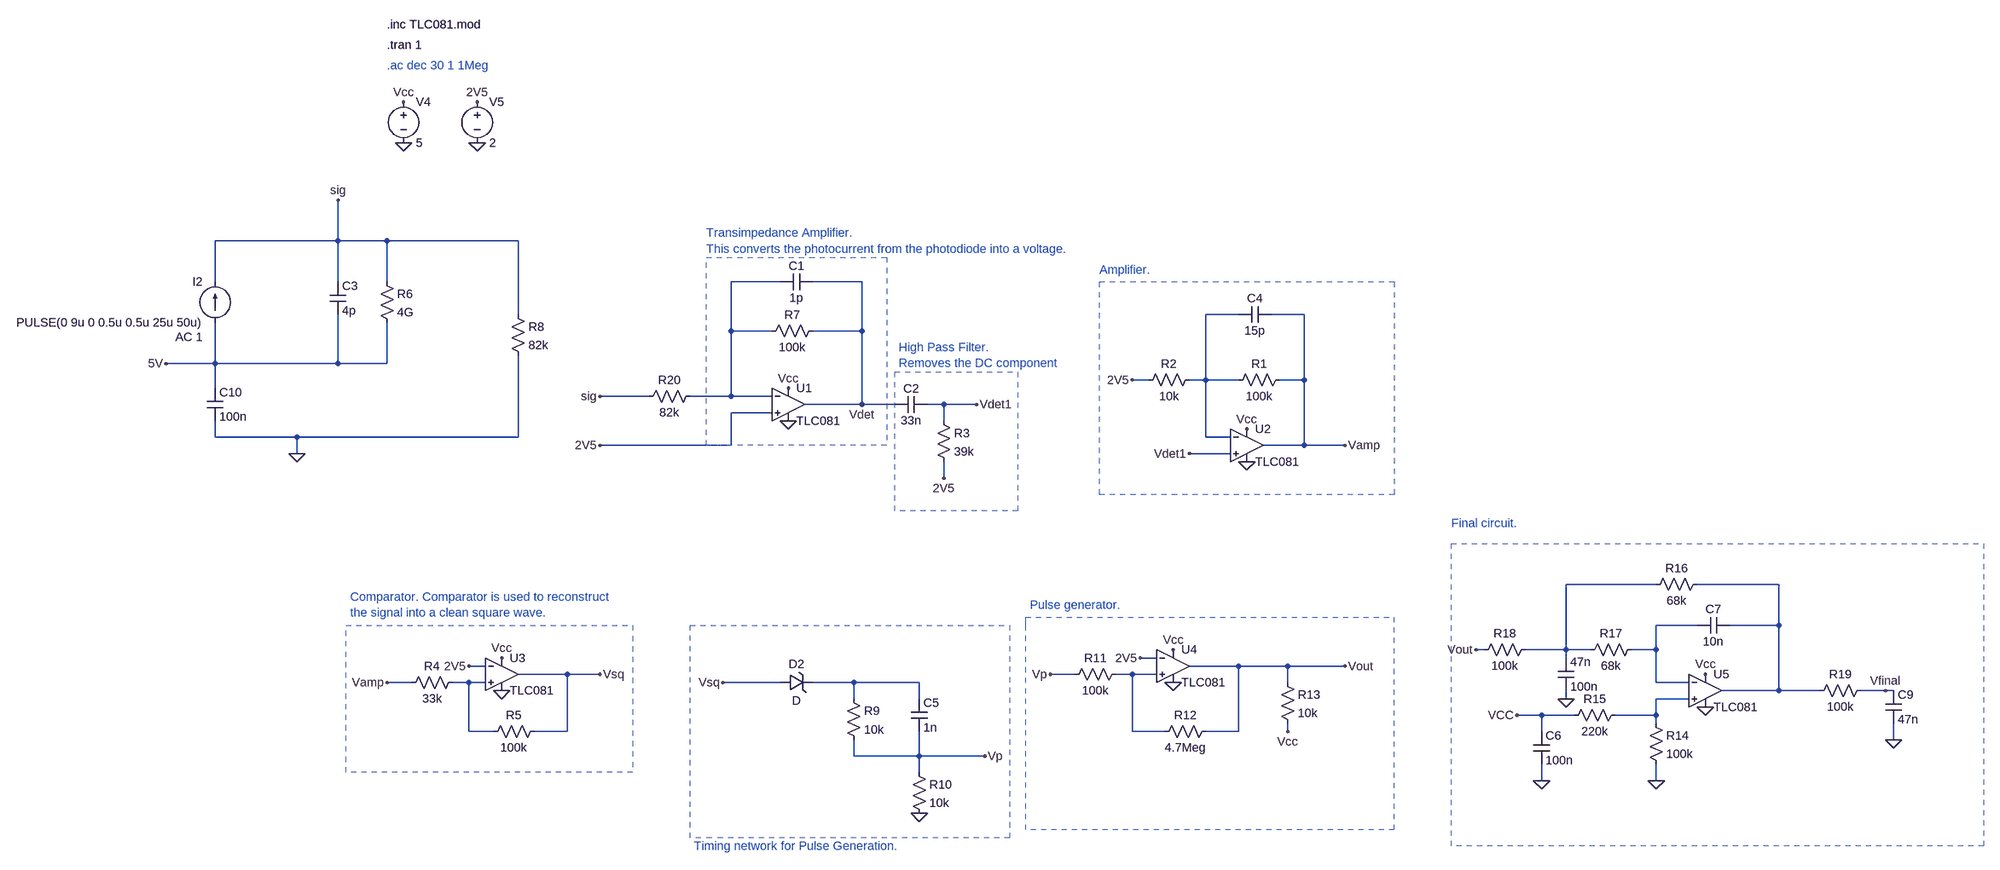
[diagram p0: schematic Receiver_finished.asc]
Receiver_finished.asc, the LTspice schematic file:
Version 4.1
SHEET 1 5412 1876
WIRE -1088 656 -1088 576
WIRE -1088 656 -1328 656
WIRE -992 656 -1088 656
WIRE -736 656 -992 656
WIRE -1328 736 -1328 656
WIRE -1088 736 -1088 656
WIRE -992 736 -992 656
WIRE -224 736 -320 736
WIRE -64 736 -160 736
WIRE -736 800 -736 656
WIRE 672 800 608 800
WIRE 800 800 736 800
WIRE -320 832 -320 736
WIRE -240 832 -320 832
WIRE -64 832 -64 736
WIRE -64 832 -160 832
WIRE -1328 896 -1328 816
WIRE -1328 896 -1424 896
WIRE -1088 896 -1088 800
WIRE -1088 896 -1328 896
WIRE -992 896 -992 816
WIRE -992 896 -1088 896
WIRE 496 928 464 928
WIRE 608 928 608 800
WIRE 608 928 576 928
WIRE 672 928 608 928
WIRE 800 928 800 800
WIRE 800 928 752 928
WIRE -1328 944 -1328 896
WIRE -480 960 -576 960
WIRE -320 960 -320 832
WIRE -320 960 -400 960
WIRE -240 960 -320 960
WIRE -64 976 -64 832
WIRE -64 976 -176 976
WIRE 0 976 -64 976
WIRE 96 976 64 976
WIRE 160 976 96 976
WIRE -240 992 -320 992
WIRE 96 1008 96 976
WIRE -1328 1040 -1328 1008
WIRE -1168 1040 -1328 1040
WIRE -736 1040 -736 880
WIRE -736 1040 -1168 1040
WIRE 608 1040 608 928
WIRE 656 1040 608 1040
WIRE -320 1056 -320 992
WIRE -320 1056 -576 1056
WIRE 800 1056 800 928
WIRE 800 1056 720 1056
WIRE 880 1056 800 1056
WIRE -1168 1072 -1168 1040
WIRE 656 1072 576 1072
WIRE 96 1120 96 1088
WIRE 1488 1328 1312 1328
WIRE 1728 1328 1568 1328
WIRE 1568 1408 1488 1408
WIRE 1728 1408 1728 1328
WIRE 1728 1408 1632 1408
WIRE 1152 1456 1136 1456
WIRE 1312 1456 1312 1328
WIRE 1312 1456 1232 1456
WIRE 1360 1456 1312 1456
WIRE 1488 1456 1488 1408
WIRE 1488 1456 1440 1456
WIRE 512 1472 480 1472
WIRE 1312 1472 1312 1456
WIRE -800 1488 -832 1488
WIRE 672 1488 576 1488
WIRE 768 1488 672 1488
WIRE 880 1488 768 1488
WIRE -640 1504 -736 1504
WIRE -576 1504 -640 1504
WIRE 352 1504 304 1504
WIRE 464 1504 432 1504
WIRE 512 1504 464 1504
WIRE -944 1520 -992 1520
WIRE -832 1520 -864 1520
WIRE -800 1520 -832 1520
WIRE -224 1520 -336 1520
WIRE -80 1520 -160 1520
WIRE 48 1520 -80 1520
WIRE 768 1520 768 1488
WIRE 1488 1520 1488 1456
WIRE 1552 1520 1488 1520
WIRE 1728 1536 1728 1408
WIRE 1728 1536 1616 1536
WIRE 1808 1536 1728 1536
WIRE 1936 1536 1888 1536
WIRE 1952 1536 1936 1536
WIRE -80 1552 -80 1520
WIRE 48 1552 48 1520
WIRE 1312 1552 1312 1536
WIRE 1552 1552 1488 1552
WIRE 1264 1584 1216 1584
WIRE 1328 1584 1264 1584
WIRE 1488 1584 1488 1552
WIRE 1488 1584 1408 1584
WIRE 1488 1600 1488 1584
WIRE -832 1616 -832 1520
WIRE -784 1616 -832 1616
WIRE -640 1616 -640 1504
WIRE -640 1616 -704 1616
WIRE 464 1616 464 1504
WIRE 528 1616 464 1616
WIRE 672 1616 672 1488
WIRE 672 1616 608 1616
WIRE 768 1616 768 1600
WIRE 1264 1616 1264 1584
WIRE 1952 1632 1952 1600
WIRE -80 1664 -80 1632
WIRE 48 1664 48 1616
WIRE 48 1664 -80 1664
WIRE 176 1664 48 1664
WIRE 48 1696 48 1664
WIRE 1264 1712 1264 1680
WIRE 1488 1712 1488 1680
FLAG -208 1008 0
FLAG -208 944 Vcc
FLAG -960 464 0
FLAG -960 384 Vcc
FLAG -816 464 0
FLAG -816 384 2V5
FLAG 464 928 2V5
FLAG 688 1088 0
FLAG 688 1024 Vcc
FLAG 576 1072 Vdet1
FLAG 96 1120 2V5
FLAG 160 976 Vdet1
FLAG -64 976 Vdet
FLAG 880 1056 Vamp
FLAG -768 1472 Vcc
FLAG -768 1536 0
FLAG -992 1520 Vamp
FLAG -832 1488 2V5
FLAG -576 1504 Vsq
FLAG 48 1776 0
FLAG -336 1520 Vsq
FLAG 176 1664 Vp
FLAG 304 1504 Vp
FLAG 480 1472 2V5
FLAG 544 1520 0
FLAG 544 1456 Vcc
FLAG 768 1616 Vcc
FLAG 1584 1504 Vcc
FLAG 1584 1568 0
FLAG -1088 576 sig
FLAG -1424 896 5V
FLAG -1168 1072 0
FLAG 880 1488 Vout
FLAG 1488 1712 0
FLAG 1312 1552 0
FLAG 1952 1632 0
FLAG 1136 1456 Vout
FLAG 1216 1584 VCC
FLAG 1936 1536 Vfinal
FLAG 1264 1712 0
FLAG -576 960 sig
FLAG -576 1056 2V5
SYMBOL cap -1104 736 R0
SYMATTR InstName C3
SYMATTR Value 4p
SYMBOL res -1008 720 R0
SYMATTR InstName R6
SYMATTR Value 4G
SYMBOL res -144 816 R90
WINDOW 0 0 56 VBottom 2
WINDOW 3 32 56 VTop 2
SYMATTR InstName R7
SYMATTR Value 100k
SYMBOL voltage -960 368 R0
SYMATTR InstName V4
SYMATTR Value 5
SYMBOL voltage -816 368 R0
WINDOW 123 0 0 Left 0
WINDOW 39 0 0 Left 0
SYMATTR InstName V5
SYMATTR Value 2
SYMBOL cap -160 720 R90
WINDOW 0 0 32 VBottom 2
WINDOW 3 32 32 VTop 2
SYMATTR InstName C1
SYMATTR Value 1p
SYMBOL res 768 912 R90
WINDOW 0 0 56 VBottom 2
WINDOW 3 32 56 VTop 2
SYMATTR InstName R1
SYMATTR Value 100k
SYMBOL res 592 912 R90
WINDOW 0 0 56 VBottom 2
WINDOW 3 32 56 VTop 2
SYMATTR InstName R2
SYMATTR Value 10k
SYMBOL cap 64 960 R90
WINDOW 0 0 32 VBottom 2
WINDOW 3 32 32 VTop 2
SYMATTR InstName C2
SYMATTR Value 33n
SYMBOL res 80 992 R0
SYMATTR InstName R3
SYMATTR Value 39k
SYMBOL cap 736 784 R90
WINDOW 0 0 32 VBottom 2
WINDOW 3 32 32 VTop 2
SYMATTR InstName C4
SYMATTR Value 15p
SYMBOL res -848 1504 R90
WINDOW 0 0 56 VBottom 2
WINDOW 3 32 56 VTop 2
SYMATTR InstName R4
SYMATTR Value 33k
SYMBOL res -688 1600 R90
WINDOW 0 0 56 VBottom 2
WINDOW 3 32 56 VTop 2
SYMATTR InstName R5
SYMATTR Value 100k
SYMBOL zener -224 1536 R270
WINDOW 0 36 32 VTop 2
WINDOW 3 -4 32 VBottom 2
SYMATTR InstName D2
SYMBOL res -96 1536 R0
SYMATTR InstName R9
SYMATTR Value 10k
SYMBOL cap 32 1552 R0
SYMATTR InstName C5
SYMATTR Value 1n
SYMBOL res 32 1680 R0
SYMATTR InstName R10
SYMATTR Value 10k
SYMBOL res 448 1488 R90
WINDOW 0 0 56 VBottom 2
WINDOW 3 32 56 VTop 2
SYMATTR InstName R11
SYMATTR Value 100k
SYMBOL res 624 1600 R90
WINDOW 0 0 56 VBottom 2
WINDOW 3 32 56 VTop 2
SYMATTR InstName R12
SYMATTR Value 4.7Meg
SYMBOL res 752 1504 R0
SYMATTR InstName R13
SYMATTR Value 10k
SYMBOL OpAmps\\opamp2 -208 912 R0
SYMATTR InstName U1
SYMATTR Value TLC081
SYMBOL OpAmps\\opamp2 688 992 R0
SYMATTR InstName U2
SYMATTR Value TLC081
SYMBOL OpAmps\\opamp2 -768 1440 R0
SYMATTR InstName U3
SYMATTR Value TLC081
SYMBOL OpAmps\\opamp2 544 1424 R0
SYMATTR InstName U4
SYMATTR Value TLC081
SYMBOL OpAmps\\opamp2 1584 1472 R0
SYMATTR InstName U5
SYMATTR Value TLC081
SYMBOL res -384 944 R90
WINDOW 0 0 56 VBottom 2
WINDOW 3 32 56 VTop 2
SYMATTR InstName R20
SYMATTR Value 82k
SYMBOL current -1328 816 R180
WINDOW 0 24 80 Left 2
WINDOW 3 24 0 Left 2
WINDOW 123 24 -28 Left 2
WINDOW 39 0 0 Left 0
SYMATTR InstName I2
SYMATTR Value PULSE(0 9u 0 0.5u 0.5u 25u 50u)
SYMATTR Value2 AC 1
SYMBOL cap -1344 944 R0
SYMATTR InstName C10
SYMATTR Value 100n
SYMBOL res -752 784 R0
SYMATTR InstName R8
SYMATTR Value 82k
SYMBOL res 1472 1584 R0
SYMATTR InstName R14
SYMATTR Value 100k
SYMBOL res 1424 1568 R90
WINDOW 0 0 56 VBottom 2
WINDOW 3 32 56 VTop 2
SYMATTR InstName R15
SYMATTR Value 220k
SYMBOL cap 1632 1392 R90
WINDOW 0 0 32 VBottom 2
WINDOW 3 32 32 VTop 2
SYMATTR InstName C7
SYMATTR Value 10n
SYMBOL res 1584 1312 R90
WINDOW 0 0 56 VBottom 2
WINDOW 3 32 56 VTop 2
SYMATTR InstName R16
SYMATTR Value 68k
SYMBOL res 1456 1440 R90
WINDOW 0 0 56 VBottom 2
WINDOW 3 32 56 VTop 2
SYMATTR InstName R17
SYMATTR Value 68k
SYMBOL res 1248 1440 R90
WINDOW 0 0 56 VBottom 2
WINDOW 3 32 56 VTop 2
SYMATTR InstName R18
SYMATTR Value 100k
SYMBOL cap 1296 1472 R0
SYMATTR InstName 47n
SYMATTR Value 100n
SYMBOL res 1904 1520 R90
WINDOW 0 0 56 VBottom 2
WINDOW 3 32 56 VTop 2
SYMATTR InstName R19
SYMATTR Value 100k
SYMBOL cap 1936 1536 R0
SYMATTR InstName C9
SYMATTR Value 47n
SYMBOL cap 1248 1616 R0
SYMATTR InstName C6
SYMATTR Value 100n
TEXT -992 272 Left 2 !.tran 1
TEXT -992 232 Left 2 !.inc TLC081.mod
TEXT -992 312 Left 2 ;.ac dec 30 1 1Meg
TEXT 1088 1208 Left 2 ;Final circuit.
TEXT 8 864 Left 2 ;High Pass Filter.\nRemoves the DC component
TEXT -368 640 Left 2 ;Transimpedance Amplifier.\nThis converts the photocurrent from the photodiode into a voltage.
TEXT 400 712 Left 2 ;Amplifier.
TEXT -1064 1352 Left 2 ;Comparator. Comparator is used to reconstruct\nthe signal into a clean square wave.
TEXT -392 1840 Left 2 ;Timing network for Pulse Generation.
TEXT 264 1368 Left 2 ;Pulse generator.
LINE Normal 224 1824 -336 1824 2
LINE Normal 224 1408 224 1824 2
LINE Normal -400 1408 224 1408 2
LINE Normal -400 1824 -400 1408 2
LINE Normal -336 1824 -400 1824 2
LINE Normal 256 1808 256 1408 2
LINE Normal 256 1392 976 1392 2
LINE Normal 256 1408 256 1392 2
LINE Normal 976 1808 976 1392 2
LINE Normal 976 1808 256 1808 2
RECTANGLE Normal -16 1056 -368 688 2
RECTANGLE Normal 240 1184 0 912 2
RECTANGLE Normal 976 1152 400 736 2
RECTANGLE Normal -512 1696 -1072 1408 2
RECTANGLE Normal 2128 1840 1088 1248 2

The netlist it stands for:
* Receiver_finished.asc
C3 sig 5V 4p
R6 sig 5V 4G
R7 Vdet N001 100k
V4 Vcc 0 5
V5 2V5 0 2
C1 Vdet N001 1p
R1 Vamp N002 100k
R2 N002 2V5 10k
C2 Vdet1 Vdet 33n
R3 Vdet1 2V5 39k
C4 Vamp N002 15p
R4 N007 Vamp 33k
R5 Vsq N007 100k
D2 Vsq N008 D
R9 N008 Vp 10k
C5 N008 Vp 1n
R10 Vp 0 10k
R11 N006 Vp 100k
R12 Vout N006 4.7Meg
R13 Vout Vcc 10k
X§U1 2V5 N001 Vcc 0 Vdet TLC081  ; pins In+ In- V+ V- OUT
X§U2 Vdet1 N002 Vcc 0 Vamp TLC081  ; pins In+ In- V+ V- OUT
X§U3 N007 2V5 Vcc 0 Vsq TLC081  ; pins In+ In- V+ V- OUT
X§U4 N006 2V5 Vcc 0 Vout TLC081  ; pins In+ In- V+ V- OUT
X§U5 N009 N005 Vcc 0 N004 TLC081  ; pins In+ In- V+ V- OUT
R20 N001 sig 82k
I2 5V sig PULSE(0 9u 0 0.5u 0.5u 25u 50u) AC 1
C10 5V 0 100n
R8 sig 0 82k
R14 N009 0 100k
R15 N009 Vcc 220k
C7 N004 N005 10n
R16 N004 N003 68k
R17 N005 N003 68k
R18 N003 Vout 100k
C§47n N003 0 100n
R19 Vfinal N004 100k
C9 Vfinal 0 47n
C6 Vcc 0 100n
.model D D
.lib standard.dio
.tran 1
.inc TLC081.mod
* .ac dec 30 1 1Meg
* Final circuit.
* High Pass Filter.
* Removes the DC component
* Transimpedance Amplifier.
* This converts the photocurrent from the photodiode into a voltage.
* Amplifier.
* Comparator. Comparator is used to reconstruct
* the signal into a clean square wave.
* Timing network for Pulse Generation.
* Pulse generator.
.backanno
.end